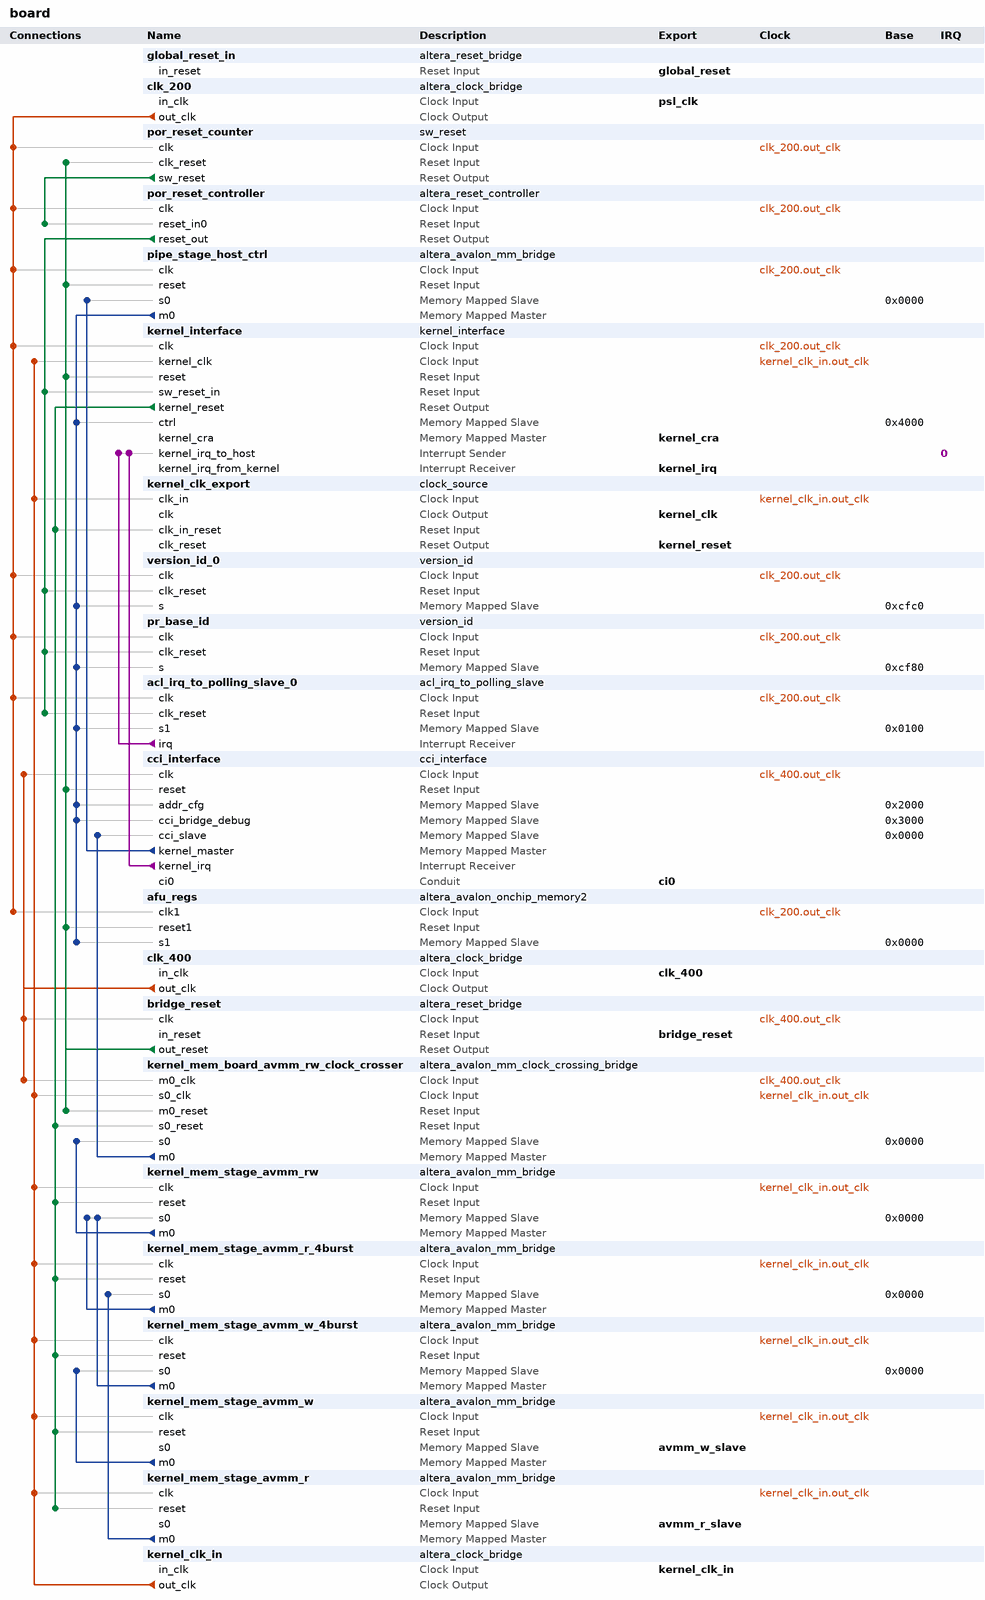
[diagram p0: system contents]
# Platform Designer (Qsys) system board, Arria 10 10AX115U3F45E2SGE3
# Parameters at their usual value, and those the tool derives, are not listed.
package require -exact qsys 16.0
create_system board
set_project_property DEVICE_FAMILY {Arria 10}
set_project_property DEVICE 10AX115U3F45E2SGE3

add_instance global_reset_in altera_reset_bridge 16.0
set_instance_parameter_value global_reset_in ACTIVE_LOW_RESET 1
set_instance_parameter_value global_reset_in SYNCHRONOUS_EDGES none

add_instance clk_200 altera_clock_bridge 16.0
set_instance_parameter_value clk_200 DERIVED_CLOCK_RATE 0
set_instance_parameter_value clk_200 EXPLICIT_CLOCK_RATE 100

add_instance por_reset_counter sw_reset 10.0
set_instance_parameter_value por_reset_counter LOG2_RESET_CYCLES 10
set_instance_parameter_value por_reset_counter WIDTH 8

add_instance por_reset_controller altera_reset_controller 16.0
set_instance_parameter_value por_reset_controller NUM_RESET_INPUTS 1
set_instance_parameter_value por_reset_controller SYNC_DEPTH 2

add_instance pipe_stage_host_ctrl altera_avalon_mm_bridge 16.0
set_instance_parameter_value pipe_stage_host_ctrl ADDRESS_UNITS SYMBOLS
set_instance_parameter_value pipe_stage_host_ctrl ADDRESS_WIDTH 21
set_instance_parameter_value pipe_stage_host_ctrl DATA_WIDTH 32
set_instance_parameter_value pipe_stage_host_ctrl MAX_PENDING_RESPONSES 1
set_instance_parameter_value pipe_stage_host_ctrl USE_AUTO_ADDRESS_WIDTH 1

add_instance kernel_interface kernel_interface 15.1
set_instance_parameter_value kernel_interface ENABLE_ROM_RECONFIGURE 1
set_instance_parameter_value kernel_interface NUM_GLOBAL_MEMS 1

add_instance kernel_clk_export clock_source 16.0
set_instance_parameter_value kernel_clk_export clockFrequency 50000000
set_instance_parameter_value kernel_clk_export clockFrequencyKnown false
set_instance_parameter_value kernel_clk_export resetSynchronousEdges DEASSERT

add_instance version_id_0 version_id 10.0
set_instance_parameter_value version_id_0 VERSION_ID 1298131504
set_instance_parameter_value version_id_0 WIDTH 32

add_instance pr_base_id version_id 10.0
set_instance_parameter_value pr_base_id VERSION_ID 1284905767
set_instance_parameter_value pr_base_id WIDTH 32

add_instance acl_irq_to_polling_slave_0 acl_irq_to_polling_slave 10.0
set_instance_parameter_value acl_irq_to_polling_slave_0 DATA_WIDTH 32

add_instance cci_interface cci_interface 1.0

add_instance afu_regs altera_avalon_onchip_memory2 16.0
set_instance_parameter_value afu_regs blockType M20K
set_instance_parameter_value afu_regs dataWidth 64
set_instance_parameter_value afu_regs dualPort false
set_instance_parameter_value afu_regs initMemContent true
set_instance_parameter_value afu_regs initializationFileName afuregs.hex
set_instance_parameter_value afu_regs memorySize 64
set_instance_parameter_value afu_regs resetrequest_enabled false
set_instance_parameter_value afu_regs useNonDefaultInitFile true
set_instance_parameter_value afu_regs writable false

add_instance clk_400 altera_clock_bridge 16.0
set_instance_parameter_value clk_400 DERIVED_CLOCK_RATE 0
set_instance_parameter_value clk_400 EXPLICIT_CLOCK_RATE 200

add_instance bridge_reset altera_reset_bridge 16.0
set_instance_parameter_value bridge_reset ACTIVE_LOW_RESET 0
set_instance_parameter_value bridge_reset SYNCHRONOUS_EDGES deassert

add_instance kernel_mem_board_avmm_rw_clock_crosser altera_avalon_mm_clock_crossing_bridge 16.0
set_instance_parameter_value kernel_mem_board_avmm_rw_clock_crosser ADDRESS_WIDTH 64
set_instance_parameter_value kernel_mem_board_avmm_rw_clock_crosser COMMAND_FIFO_DEPTH 512
set_instance_parameter_value kernel_mem_board_avmm_rw_clock_crosser DATA_WIDTH 512
set_instance_parameter_value kernel_mem_board_avmm_rw_clock_crosser MASTER_SYNC_DEPTH 4
set_instance_parameter_value kernel_mem_board_avmm_rw_clock_crosser MAX_BURST_SIZE 4
set_instance_parameter_value kernel_mem_board_avmm_rw_clock_crosser RESPONSE_FIFO_DEPTH 512
set_instance_parameter_value kernel_mem_board_avmm_rw_clock_crosser SLAVE_SYNC_DEPTH 4
set_instance_parameter_value kernel_mem_board_avmm_rw_clock_crosser USE_AUTO_ADDRESS_WIDTH 0

add_instance kernel_mem_stage_avmm_rw altera_avalon_mm_bridge 16.0
set_instance_parameter_value kernel_mem_stage_avmm_rw ADDRESS_UNITS SYMBOLS
set_instance_parameter_value kernel_mem_stage_avmm_rw ADDRESS_WIDTH 64
set_instance_parameter_value kernel_mem_stage_avmm_rw DATA_WIDTH 512
set_instance_parameter_value kernel_mem_stage_avmm_rw MAX_BURST_SIZE 4
set_instance_parameter_value kernel_mem_stage_avmm_rw MAX_PENDING_RESPONSES 512
set_instance_parameter_value kernel_mem_stage_avmm_rw USE_AUTO_ADDRESS_WIDTH 0

add_instance kernel_mem_stage_avmm_r_4burst altera_avalon_mm_bridge 16.0
set_instance_parameter_value kernel_mem_stage_avmm_r_4burst ADDRESS_UNITS SYMBOLS
set_instance_parameter_value kernel_mem_stage_avmm_r_4burst ADDRESS_WIDTH 64
set_instance_parameter_value kernel_mem_stage_avmm_r_4burst DATA_WIDTH 512
set_instance_parameter_value kernel_mem_stage_avmm_r_4burst MAX_BURST_SIZE 4
set_instance_parameter_value kernel_mem_stage_avmm_r_4burst MAX_PENDING_RESPONSES 512
set_instance_parameter_value kernel_mem_stage_avmm_r_4burst USE_AUTO_ADDRESS_WIDTH 0

add_instance kernel_mem_stage_avmm_w_4burst altera_avalon_mm_bridge 16.0
set_instance_parameter_value kernel_mem_stage_avmm_w_4burst ADDRESS_UNITS SYMBOLS
set_instance_parameter_value kernel_mem_stage_avmm_w_4burst ADDRESS_WIDTH 64
set_instance_parameter_value kernel_mem_stage_avmm_w_4burst DATA_WIDTH 512
set_instance_parameter_value kernel_mem_stage_avmm_w_4burst MAX_BURST_SIZE 4
set_instance_parameter_value kernel_mem_stage_avmm_w_4burst MAX_PENDING_RESPONSES 256
set_instance_parameter_value kernel_mem_stage_avmm_w_4burst USE_AUTO_ADDRESS_WIDTH 0

add_instance kernel_mem_stage_avmm_w altera_avalon_mm_bridge 16.0
set_instance_parameter_value kernel_mem_stage_avmm_w ADDRESS_UNITS SYMBOLS
set_instance_parameter_value kernel_mem_stage_avmm_w ADDRESS_WIDTH 64
set_instance_parameter_value kernel_mem_stage_avmm_w DATA_WIDTH 512
set_instance_parameter_value kernel_mem_stage_avmm_w MAX_BURST_SIZE 16
set_instance_parameter_value kernel_mem_stage_avmm_w MAX_PENDING_RESPONSES 64
set_instance_parameter_value kernel_mem_stage_avmm_w USE_AUTO_ADDRESS_WIDTH 0

add_instance kernel_mem_stage_avmm_r altera_avalon_mm_bridge 16.0
set_instance_parameter_value kernel_mem_stage_avmm_r ADDRESS_UNITS SYMBOLS
set_instance_parameter_value kernel_mem_stage_avmm_r ADDRESS_WIDTH 64
set_instance_parameter_value kernel_mem_stage_avmm_r DATA_WIDTH 512
set_instance_parameter_value kernel_mem_stage_avmm_r MAX_BURST_SIZE 16
set_instance_parameter_value kernel_mem_stage_avmm_r MAX_PENDING_RESPONSES 512
set_instance_parameter_value kernel_mem_stage_avmm_r USE_AUTO_ADDRESS_WIDTH 0

add_instance kernel_clk_in altera_clock_bridge 16.0
set_instance_parameter_value kernel_clk_in DERIVED_CLOCK_RATE 0
set_instance_parameter_value kernel_clk_in EXPLICIT_CLOCK_RATE 0

# connections
add_connection clk_200.out_clk acl_irq_to_polling_slave_0.clk clock
add_connection clk_200.out_clk afu_regs.clk1 clock
add_connection clk_200.out_clk kernel_interface.clk clock
add_connection clk_200.out_clk pipe_stage_host_ctrl.clk clock
add_connection clk_200.out_clk por_reset_controller.clk clock
add_connection clk_200.out_clk por_reset_counter.clk clock
add_connection clk_200.out_clk pr_base_id.clk clock
add_connection clk_200.out_clk version_id_0.clk clock
add_connection clk_400.out_clk bridge_reset.clk clock
add_connection clk_400.out_clk cci_interface.clk clock
add_connection clk_400.out_clk kernel_mem_board_avmm_rw_clock_crosser.m0_clk clock
add_connection kernel_clk_in.out_clk kernel_clk_export.clk_in clock
add_connection kernel_clk_in.out_clk kernel_interface.kernel_clk clock
add_connection kernel_clk_in.out_clk kernel_mem_board_avmm_rw_clock_crosser.s0_clk clock
add_connection kernel_clk_in.out_clk kernel_mem_stage_avmm_r.clk clock
add_connection kernel_clk_in.out_clk kernel_mem_stage_avmm_r_4burst.clk clock
add_connection kernel_clk_in.out_clk kernel_mem_stage_avmm_rw.clk clock
add_connection kernel_clk_in.out_clk kernel_mem_stage_avmm_w.clk clock
add_connection kernel_clk_in.out_clk kernel_mem_stage_avmm_w_4burst.clk clock
add_connection bridge_reset.out_reset afu_regs.reset1 reset
add_connection bridge_reset.out_reset cci_interface.reset reset
add_connection bridge_reset.out_reset kernel_interface.reset reset
add_connection bridge_reset.out_reset kernel_mem_board_avmm_rw_clock_crosser.m0_reset reset
add_connection bridge_reset.out_reset pipe_stage_host_ctrl.reset reset
add_connection bridge_reset.out_reset por_reset_counter.clk_reset reset
add_connection kernel_interface.kernel_reset kernel_clk_export.clk_in_reset reset
add_connection kernel_interface.kernel_reset kernel_mem_board_avmm_rw_clock_crosser.s0_reset reset
add_connection kernel_interface.kernel_reset kernel_mem_stage_avmm_r.reset reset
add_connection kernel_interface.kernel_reset kernel_mem_stage_avmm_r_4burst.reset reset
add_connection kernel_interface.kernel_reset kernel_mem_stage_avmm_rw.reset reset
add_connection kernel_interface.kernel_reset kernel_mem_stage_avmm_w.reset reset
add_connection kernel_interface.kernel_reset kernel_mem_stage_avmm_w_4burst.reset reset
add_connection por_reset_controller.reset_out acl_irq_to_polling_slave_0.clk_reset reset
add_connection por_reset_controller.reset_out kernel_interface.sw_reset_in reset
add_connection por_reset_controller.reset_out pr_base_id.clk_reset reset
add_connection por_reset_controller.reset_out version_id_0.clk_reset reset
add_connection por_reset_counter.sw_reset por_reset_controller.reset_in0 reset
add_connection cci_interface.kernel_master pipe_stage_host_ctrl.s0 avalon
set_connection_parameter_value cci_interface.kernel_master/pipe_stage_host_ctrl.s0 baseAddress 0x0000
add_connection kernel_mem_board_avmm_rw_clock_crosser.m0 cci_interface.cci_slave avalon
set_connection_parameter_value kernel_mem_board_avmm_rw_clock_crosser.m0/cci_interface.cci_slave baseAddress 0x0000
add_connection kernel_mem_stage_avmm_r.m0 kernel_mem_stage_avmm_r_4burst.s0 avalon
set_connection_parameter_value kernel_mem_stage_avmm_r.m0/kernel_mem_stage_avmm_r_4burst.s0 baseAddress 0x0000
add_connection kernel_mem_stage_avmm_r_4burst.m0 kernel_mem_stage_avmm_rw.s0 avalon
set_connection_parameter_value kernel_mem_stage_avmm_r_4burst.m0/kernel_mem_stage_avmm_rw.s0 baseAddress 0x0000
add_connection kernel_mem_stage_avmm_rw.m0 kernel_mem_board_avmm_rw_clock_crosser.s0 avalon
set_connection_parameter_value kernel_mem_stage_avmm_rw.m0/kernel_mem_board_avmm_rw_clock_crosser.s0 baseAddress 0x0000
add_connection kernel_mem_stage_avmm_w.m0 kernel_mem_stage_avmm_w_4burst.s0 avalon
set_connection_parameter_value kernel_mem_stage_avmm_w.m0/kernel_mem_stage_avmm_w_4burst.s0 baseAddress 0x0000
add_connection kernel_mem_stage_avmm_w_4burst.m0 kernel_mem_stage_avmm_rw.s0 avalon
set_connection_parameter_value kernel_mem_stage_avmm_w_4burst.m0/kernel_mem_stage_avmm_rw.s0 baseAddress 0x0000
add_connection pipe_stage_host_ctrl.m0 acl_irq_to_polling_slave_0.s1 avalon
set_connection_parameter_value pipe_stage_host_ctrl.m0/acl_irq_to_polling_slave_0.s1 baseAddress 0x0100
add_connection pipe_stage_host_ctrl.m0 afu_regs.s1 avalon
set_connection_parameter_value pipe_stage_host_ctrl.m0/afu_regs.s1 baseAddress 0x0000
add_connection pipe_stage_host_ctrl.m0 cci_interface.addr_cfg avalon
set_connection_parameter_value pipe_stage_host_ctrl.m0/cci_interface.addr_cfg baseAddress 0x2000
add_connection pipe_stage_host_ctrl.m0 cci_interface.cci_bridge_debug avalon
set_connection_parameter_value pipe_stage_host_ctrl.m0/cci_interface.cci_bridge_debug baseAddress 0x3000
add_connection pipe_stage_host_ctrl.m0 kernel_interface.ctrl avalon
set_connection_parameter_value pipe_stage_host_ctrl.m0/kernel_interface.ctrl baseAddress 0x4000
add_connection pipe_stage_host_ctrl.m0 pr_base_id.s avalon
set_connection_parameter_value pipe_stage_host_ctrl.m0/pr_base_id.s baseAddress 0xcf80
add_connection pipe_stage_host_ctrl.m0 version_id_0.s avalon
set_connection_parameter_value pipe_stage_host_ctrl.m0/version_id_0.s baseAddress 0xcfc0
add_connection acl_irq_to_polling_slave_0.irq kernel_interface.kernel_irq_to_host interrupt
set_connection_parameter_value acl_irq_to_polling_slave_0.irq/kernel_interface.kernel_irq_to_host irqNumber 0
add_connection cci_interface.kernel_irq kernel_interface.kernel_irq_to_host interrupt
set_connection_parameter_value cci_interface.kernel_irq/kernel_interface.kernel_irq_to_host irqNumber 0

# exported interfaces
add_interface avmm_r_slave avalon slave
set_interface_property avmm_r_slave EXPORT_OF kernel_mem_stage_avmm_r.s0
add_interface avmm_w_slave avalon slave
set_interface_property avmm_w_slave EXPORT_OF kernel_mem_stage_avmm_w.s0
add_interface bridge_reset reset sink
set_interface_property bridge_reset EXPORT_OF bridge_reset.in_reset
add_interface ci0 conduit end
set_interface_property ci0 EXPORT_OF cci_interface.ci0
add_interface clk_400 clock sink
set_interface_property clk_400 EXPORT_OF clk_400.in_clk
add_interface global_reset reset sink
set_interface_property global_reset EXPORT_OF global_reset_in.in_reset
add_interface kernel_clk clock source
set_interface_property kernel_clk EXPORT_OF kernel_clk_export.clk
add_interface kernel_clk_in clock sink
set_interface_property kernel_clk_in EXPORT_OF kernel_clk_in.in_clk
add_interface kernel_cra avalon master
set_interface_property kernel_cra EXPORT_OF kernel_interface.kernel_cra
add_interface kernel_irq interrupt receiver
set_interface_property kernel_irq EXPORT_OF kernel_interface.kernel_irq_from_kernel
add_interface kernel_reset reset source
set_interface_property kernel_reset EXPORT_OF kernel_clk_export.clk_reset
add_interface psl_clk clock sink
set_interface_property psl_clk EXPORT_OF clk_200.in_clk

set_interconnect_requirement {$system} qsys_mm.clockCrossingAdapter FIFO
set_interconnect_requirement {$system} qsys_mm.maxAdditionalLatency 4

save_system board.qsys
